# Altium schematic sheet 01-Change-Log.SchDoc: Change log.
size 297 x 209 mm; Author: Dmitry Shpakov; Organization: NoName; Revision: Revision; PageSize: A4; ProjectName: Project Name
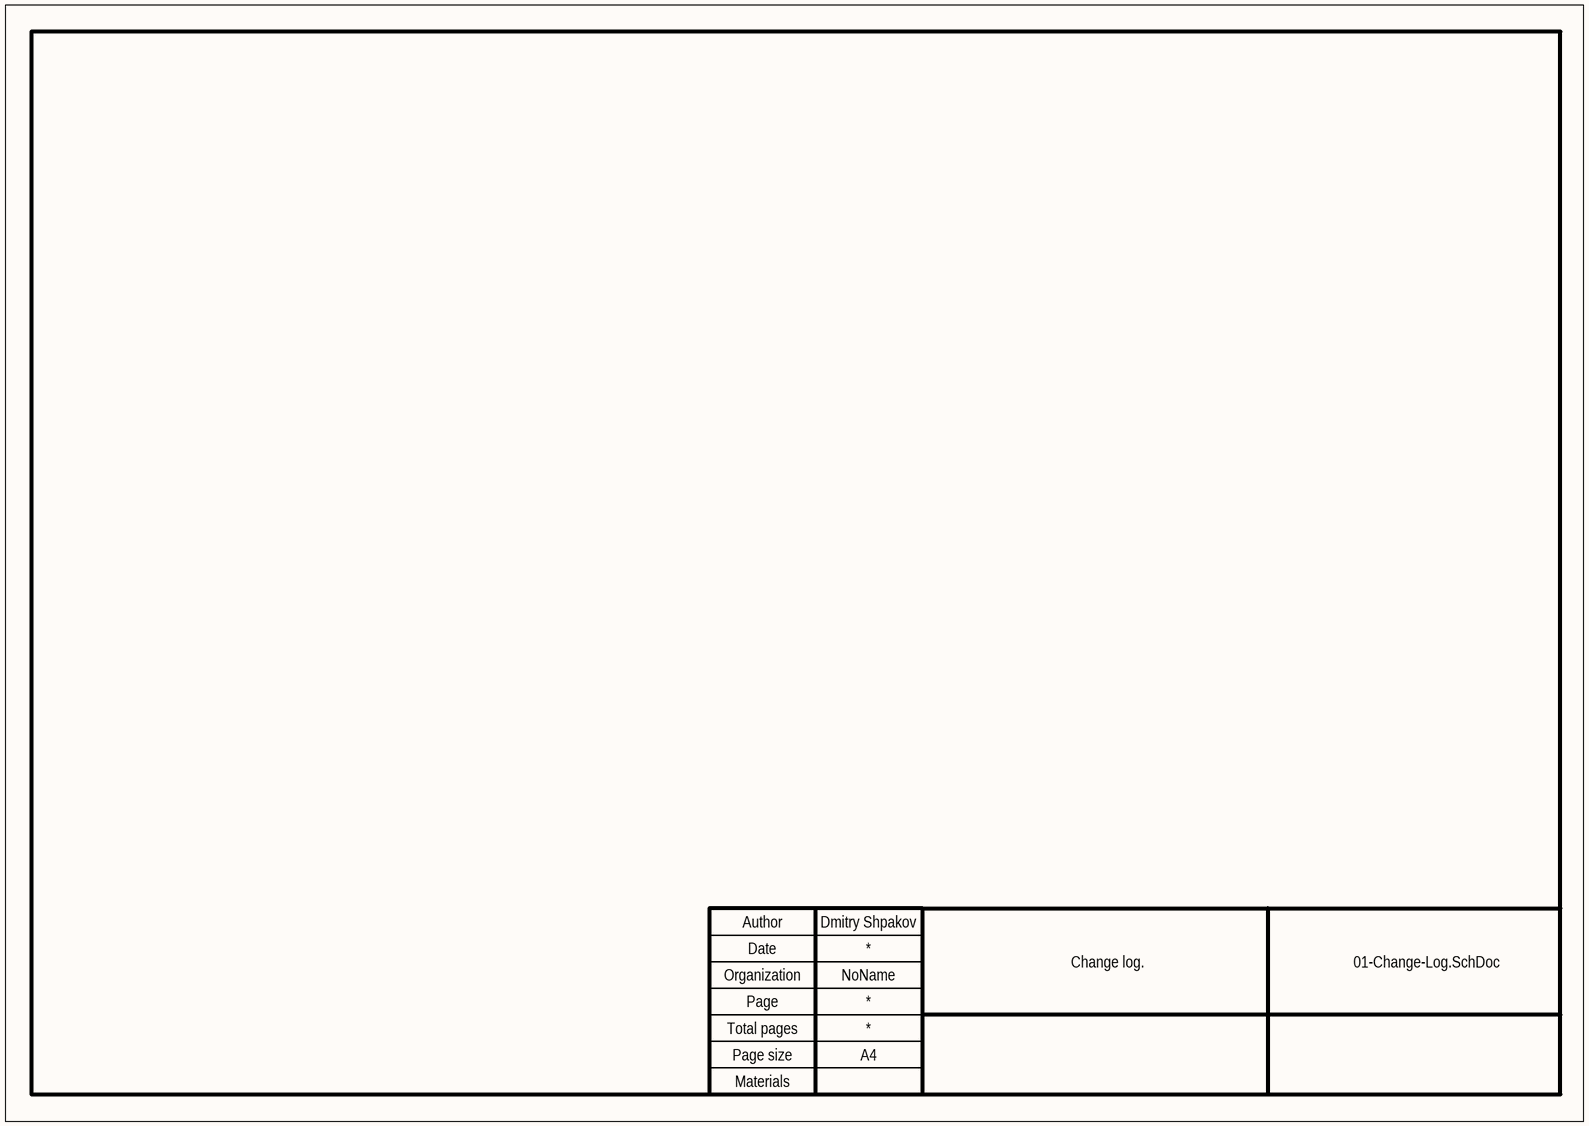
[diagram p0: 01-Change-Log.SchDoc]

## Notes on the sheet
- Author
- Date
- Organization
- Page
- Total pages
- Materials
- Page size